# EAGLE schematic LP-measurment_v15 (EAGLE 9.7.0)
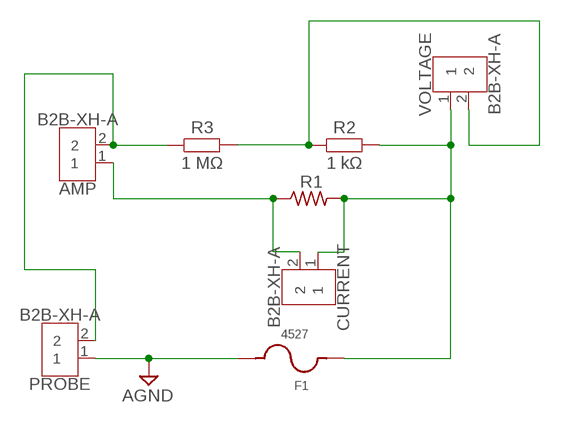
[diagram p0: schematic, sheet 1]

## Parts
AMP  B2B-XH-A  [B2B-XH-A]
CURRENT  B2B-XH-A  [B2B-XH-A]
F1  4527  [4527]
PROBE  B2B-XH-A  [B2B-XH-A]
R1  R-US_0817/22  [P0817/22]
R2  1 kΩ  R_AXIAL-11.7MM-PITCH  [RESAD1176W63L850D250B]
R3  1 MΩ  R_AXIAL-11.7MM-PITCH  [RESAD1176W63L850D250B]
VOLTAGE  B2B-XH-A  [B2B-XH-A]

## Nets
AGND: F1.2 PROBE.1
N$1: CURRENT.1 F1.1 R1.2 R2.2 VOLTAGE.1
N$2: AMP.2 PROBE.2 R3.1
N$3: AMP.1 CURRENT.2 R1.1
N$5: R2.1 R3.2 VOLTAGE.2

## Library data of the parts
AMP CURRENT PROBE VOLTAGE = Connector:B2B-XH-A: XH Connector Top Entry - 2POS Details see: Datasheet <http://www.jst-mfg.com/product/pdf/eng/eXH.pdf>; CATEGORY: Header; DATASHEET: https://www.jst-mfg.com/product/pdf/eng/eXH.pdf?67404de0bbae1; DESCRIPTION: Connector Header Through Hole 2 position 0.098" (2.50mm); MANUFACTURER: JST Sales America Inc.; MPN: B2B-XH-A; OPERATING_TEMPERATURE: -25°C ~ 85°C; PACKAGE_SIZE: NA; PACKAGE_TYPE: THT; PART_STATUS: ACTIVE; PITCH: 0.098" (2.50mm); ROHS: COMPLIANT; SERIES: XH; SUBCATEGORY: Rectangular Connectors; TYPE: Header-Male Pin-Board to Cable/Wire-Through Hole
F1 = Fuse Holder:4527: FUSE HLDR CARTRIDGE 250V 5A PCB Manufacturer's datasheet <https://www.keyelco.com/userAssets/file/M65p44.pdf>; CREATED_BY: PCBLayout.com; DIGIKEY_PN: 36-4527-ND; MANUFACTURER: Keystone Electronics; MPN: 4527
R1 = adafruit:R-US_: RESISTOR, American symbol
R2 R3 = Resistor:R: Resistor Fixed - Generic; CATEGORY: Resistors; DESCRIPTION: Axial Resistor 11.76 mm pitch 8.5 mm body length 2.5 mm body diameter; PACKAGE_SIZE: AXIAL; PACKAGE_TYPE: THT